# EAGLE board EEZ DIB MCU r3B3 (EAGLE 7.2.0), part 1 of 2
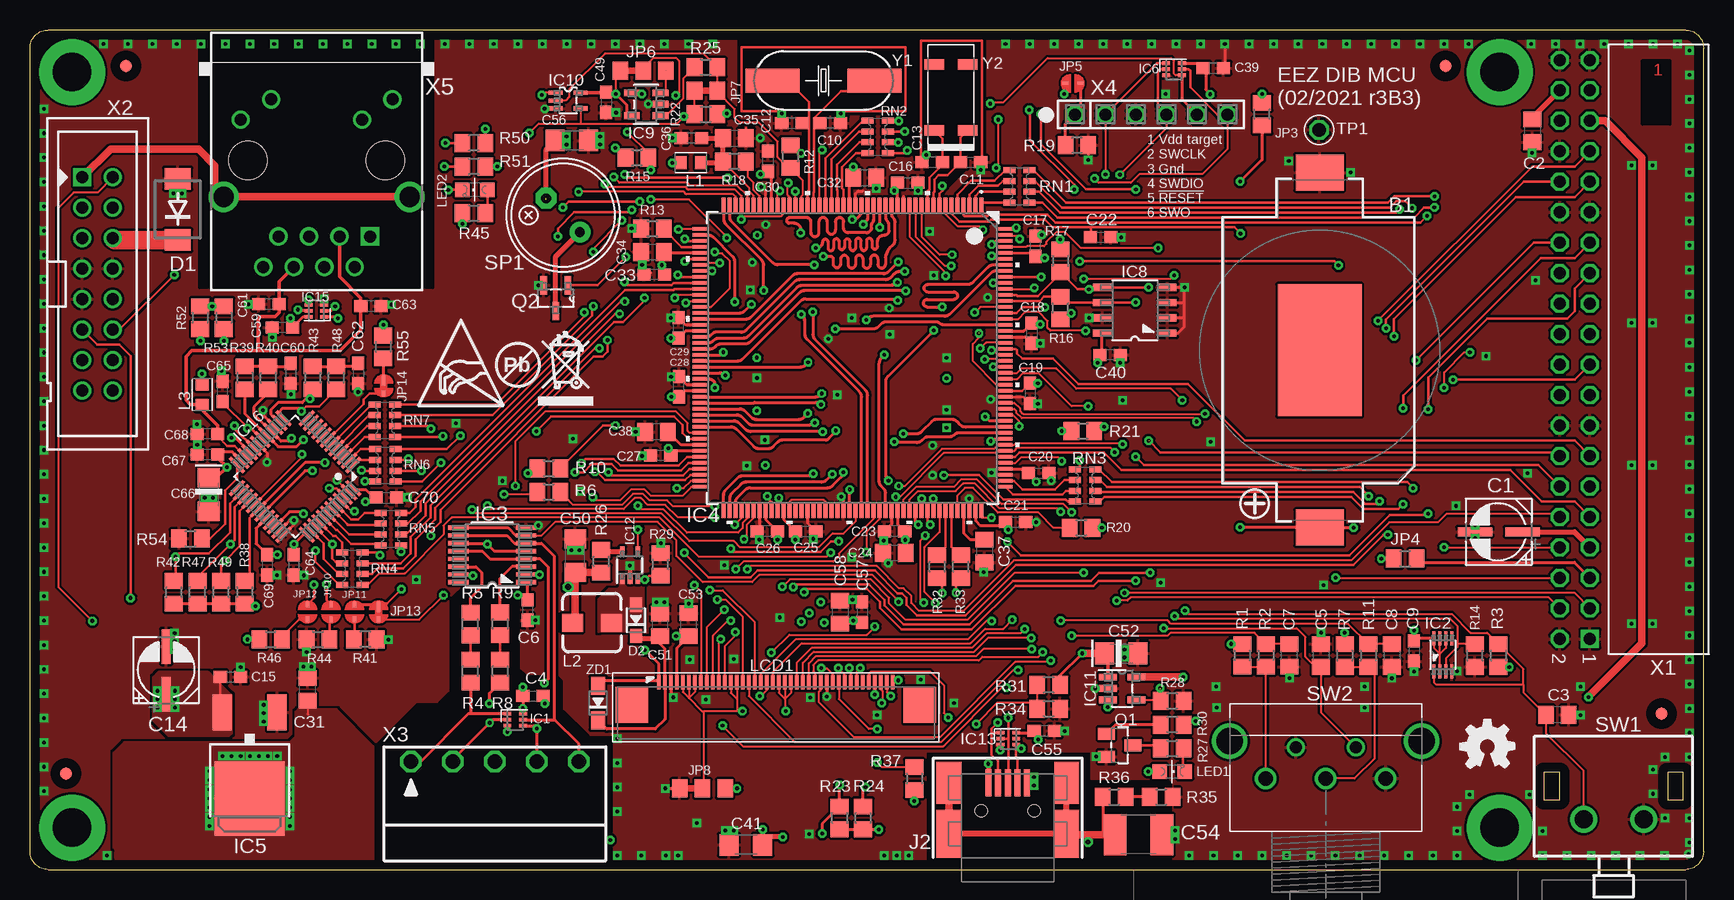
[diagram p5: board, top side]
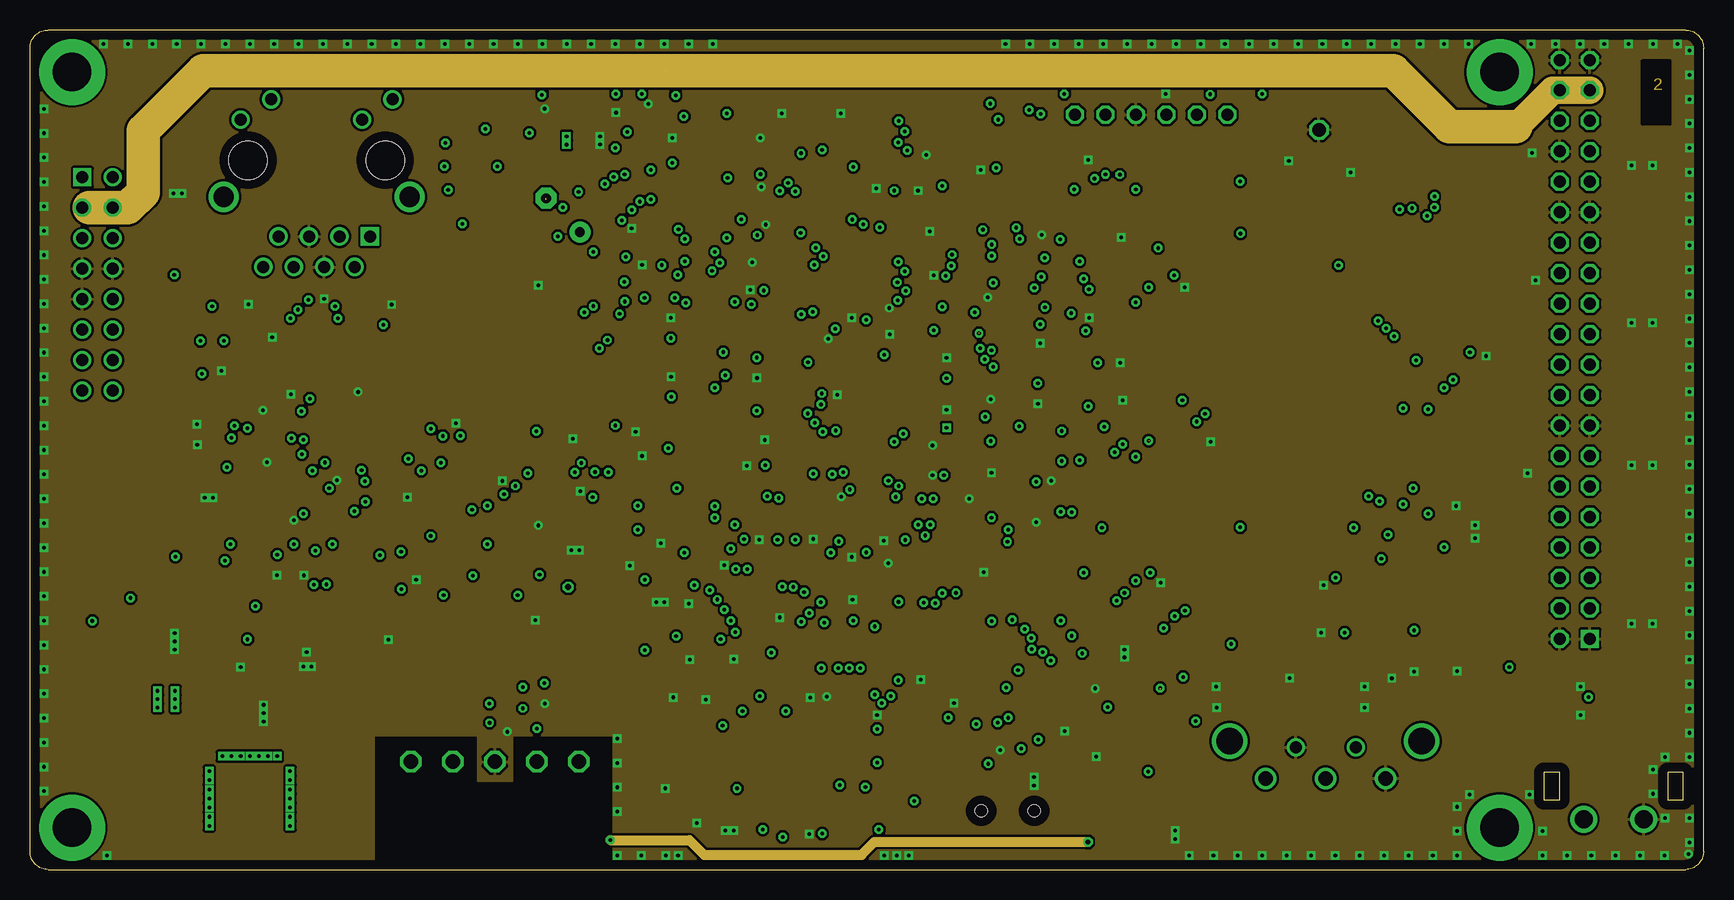
[diagram p6: board, inner layer Gnd]
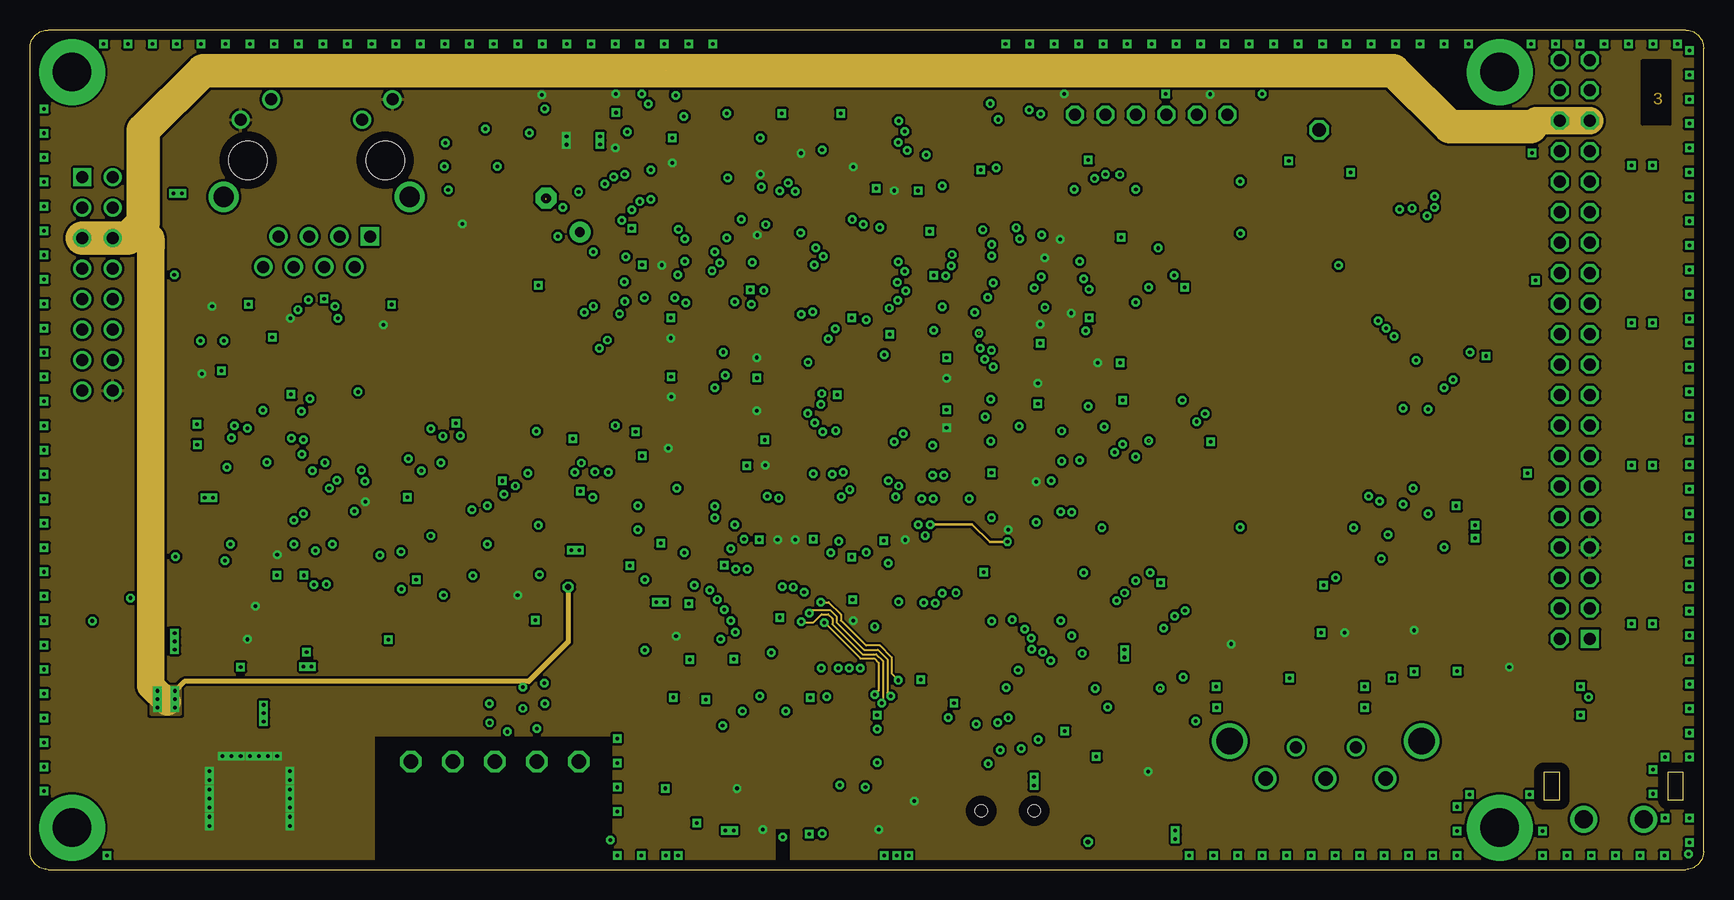
[diagram p7: board, inner layer Power]
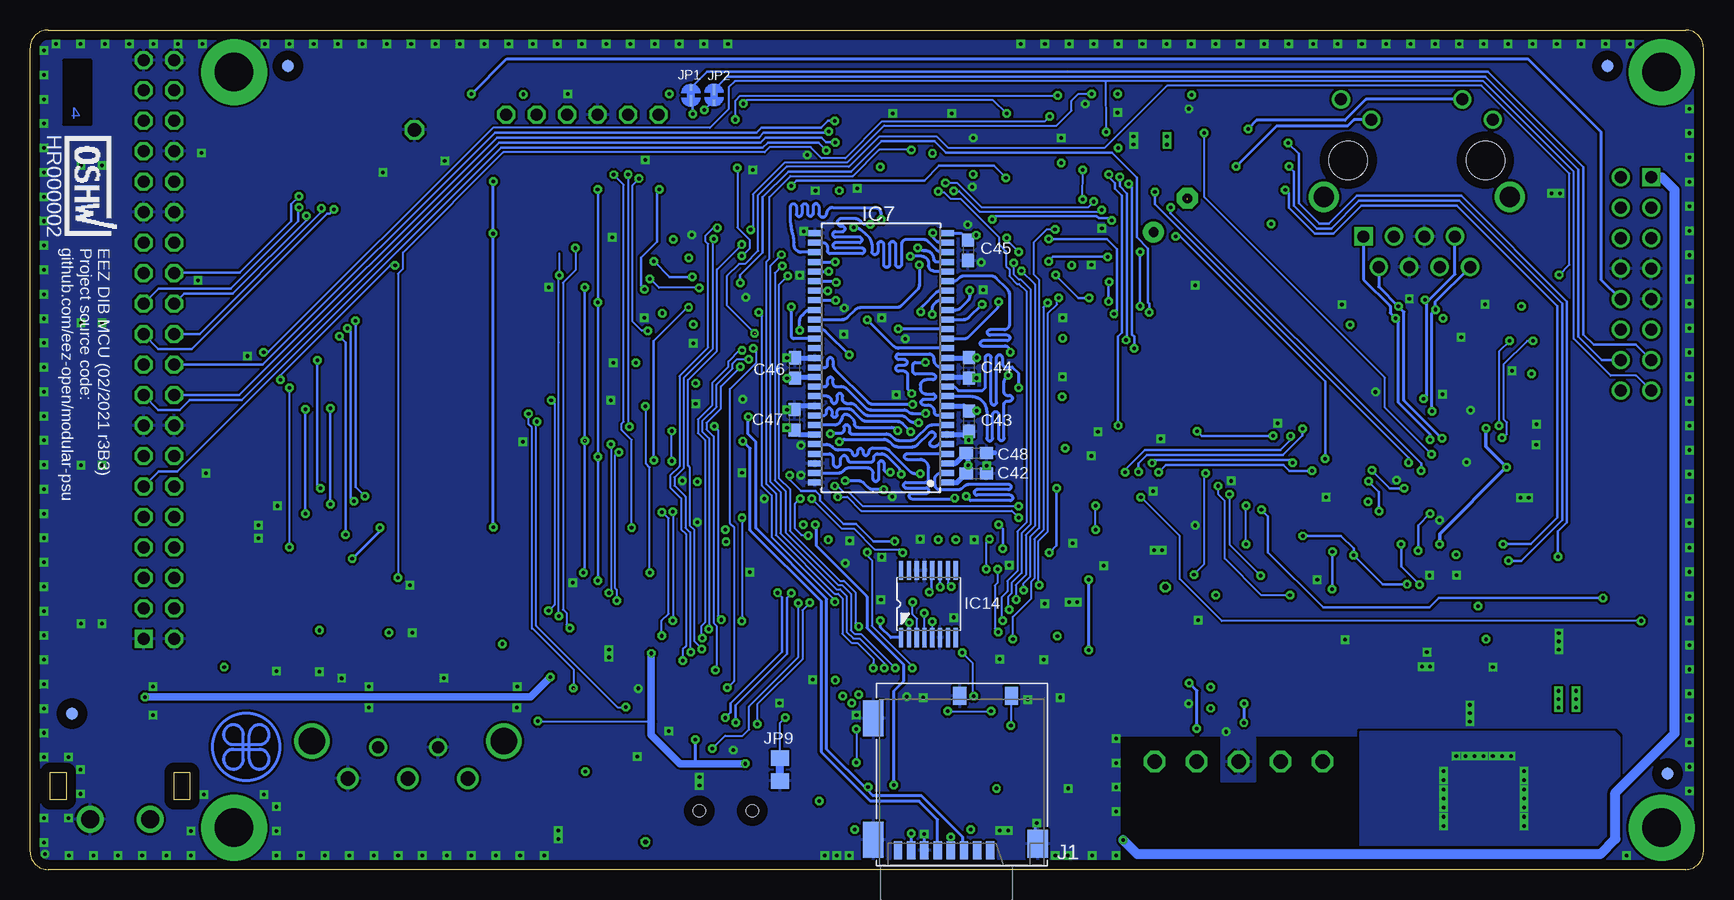
[diagram p8: board, bottom side, seen from below]

Size 139.5 x 70 mm. Coordinates in mm from the lower left corner, seen from the top.
Outline: 1.5,0 138,0 arc90 139.5,1.5 139.5,68.5 arc90 138,70 1.5,70 arc90 0,68.5 0,1.5 arc90 1.5,0
Copper layers (1+2+15+16): Top 0.035559375mm / dielectric 7mil / Gnd 0.03048125mm / dielectric 44mil / Power 0.03048125mm / dielectric 7mil / Bottom 0.035559375mm
Design rules "DIB 4-layer": minimum track width 6mil, minimum drill 0.3mm, track to track 4mil, track to pad 4mil, pad to pad 4mil, via to via 4mil, smd to smd 4mil, copper to edge 30mil, drill to drill 8mil, minimum pad ring 4mil, minimum via ring 8mil, stop-mask expansion 2.5mil, vias tented up to drill 0.6mm, thermal gap 8mil
Net classes: 0 default: width 0.152 mm, drill 0.3 mm, clearance 0.203 mm; 1 diff: width 0.229 mm, drill 0.3 mm, clearance 0.203 mm; 2 gnd: width 0.152 mm, drill 0.3 mm, clearance 0.203 mm

## Footprints (pad centres in the part's own frame; a part is rotated, then mirrored left to right if it is on the bottom)
DS1092-10-W6L = smd 3 x 4: + 14.8,0; - -14.8,0 | smd 11 x 7: PS1 0,0
PANASONIC_C = smd 2.87 x 0.762: 1 -1.981,0; 2 1.981,0
C0805 = smd 1.3 x 1.5: 1 -0.95,0; 2 0.95,0
C0603 = smd 1.1 x 1: 1 -0.85,0; 2 0.85,0
C1206 = smd 1.6 x 1.8: 1 -1.4,0; 2 1.4,0
EC1206 = smd 1.6 x 1.8: + -1.4,0; - 1.4,0
C1812 = smd 1.9 x 3.4: 1 -1.95,0; 2 1.95,0
DO214AA = smd 1.8 x 2.2: A 2.55,0; C -2.55,0
SOD323-R = smd 1.2 x 1: A 1.3,0; C -1.3,0
FIDUCIAL = smd 1.016 x 1.016: T 0,0
DRL6 = smd 0.654 x 0.301: 1 -0.65,0.5; 2 -0.65,0; 3 -0.65,-0.5; 4 0.65,-0.5; 5 0.65,0; 6 0.65,0.5
DCU8 = smd 1.168 x 0.254: 1 -1.372,0.75; 2 -1.372,0.25; 3 -1.372,-0.25; 4 -1.372,-0.75; 5 1.372,-0.75; 6 1.372,-0.25; 7 1.372,0.25; 8 1.372,0.75
PW16 = smd 1.676 x 0.356: 1 -2.819,2.275; 2 -2.819,1.625; 3 -2.819,0.975; 4 -2.819,0.325; 5 -2.819,-0.325; 6 -2.819,-0.975; 7 -2.819,-1.625; 8 -2.819,-2.275; 9 2.819,-2.275; 10 2.819,-1.625; 11 2.819,-0.975; 12 2.819,-0.325; 13 2.819,0.325; 14 2.819,0.975; 15 2.819,1.625; 16 2.819,2.275
LQFP-176_24X24MM = smd 1.2 x 0.3: 1 -12.75,10.75; 2 -12.75,10.25; 3 -12.75,9.75; 4 -12.75,9.25; 5 -12.75,8.75; 6 -12.75,8.25; 7 -12.75,7.75; 8 -12.75,7.25; 9 -12.75,6.75; 10 -12.75,6.25; 11 -12.75,5.75; 12 -12.75,5.25; 13 -12.75,4.75; 14 -12.75,4.25; 15 -12.75,3.75; 16 -12.75,3.25; 17 -12.75,2.75; 18 -12.75,2.25; 19 -12.75,1.75; 20 -12.75,1.25; 21 -12.75,0.75; 22 -12.75,0.25; 23 -12.75,-0.25; 24 -12.75,-0.75; 25 -12.75,-1.25; 26 -12.75,-1.75; 27 -12.75,-2.25; 28 -12.75,-2.75; 29 -12.75,-3.25; 30 -12.75,-3.75; 31 -12.75,-4.25; 32 -12.75,-4.75; 33 -12.75,-5.25; 34 -12.75,-5.75; 35 -12.75,-6.25; 36 -12.75,-6.75; 37 -12.75,-7.25; 38 -12.75,-7.75; 39 -12.75,-8.25; 40 -12.75,-8.75; 41 -12.75,-9.25; 42 -12.75,-9.75; 43 -12.75,-10.25; 44 -12.75,-10.75; 89 12.75,-10.75; 90 12.75,-10.25; 91 12.75,-9.75; 92 12.75,-9.25; 93 12.75,-8.75; 94 12.75,-8.25; 95 12.75,-7.75; 96 12.75,-7.25; 97 12.75,-6.75; 98 12.75,-6.25; 99 12.75,-5.75; 100 12.75,-5.25; 101 12.75,-4.75; 102 12.75,-4.25; 103 12.75,-3.75; 104 12.75,-3.25; 105 12.75,-2.75; 106 12.75,-2.25; 107 12.75,-1.75; 108 12.75,-1.25; 109 12.75,-0.75; 110 12.75,-0.25; 111 12.75,0.25; 112 12.75,0.75; 113 12.75,1.25; 114 12.75,1.75; 115 12.75,2.25; 116 12.75,2.75; 117 12.75,3.25; 118 12.75,3.75; 119 12.75,4.25; 120 12.75,4.75; 121 12.75,5.25; 122 12.75,5.75; 123 12.75,6.25; 124 12.75,6.75; 125 12.75,7.25; 126 12.75,7.75; 127 12.75,8.25; 128 12.75,8.75; 129 12.75,9.25; 130 12.75,9.75; 131 12.75,10.25; 132 12.75,10.75 | smd 0.3 x 1.2: 45 -10.75,-12.75; 46 -10.25,-12.75; 47 -9.75,-12.75; 48 -9.25,-12.75; 49 -8.75,-12.75; 50 -8.25,-12.75; 51 -7.75,-12.75; 52 -7.25,-12.75; 53 -6.75,-12.75; 54 -6.25,-12.75; 55 -5.75,-12.75; 56 -5.25,-12.75; 57 -4.75,-12.75; 58 -4.25,-12.75; 59 -3.75,-12.75; 60 -3.25,-12.75; 61 -2.75,-12.75; 62 -2.25,-12.75; 63 -1.75,-12.75; 64 -1.25,-12.75; 65 -0.75,-12.75; 66 -0.25,-12.75; 67 0.25,-12.75; 68 0.75,-12.75; 69 1.25,-12.75; 70 1.75,-12.75; 71 2.25,-12.75; 72 2.75,-12.75; 73 3.25,-12.75; 74 3.75,-12.75; 75 4.25,-12.75; 76 4.75,-12.75; 77 5.25,-12.75; 78 5.75,-12.75; 79 6.25,-12.75; 80 6.75,-12.75; 81 7.25,-12.75; 82 7.75,-12.75; 83 8.25,-12.75; 84 8.75,-12.75; 85 9.25,-12.75; 86 9.75,-12.75; 87 10.25,-12.75; 88 10.75,-12.75; 133 10.75,12.75; 134 10.25,12.75; 135 9.75,12.75; 136 9.25,12.75; 137 8.75,12.75; 138 8.25,12.75; 139 7.75,12.75; 140 7.25,12.75; 141 6.75,12.75; 142 6.25,12.75; 143 5.75,12.75; 144 5.25,12.75; 145 4.75,12.75; 146 4.25,12.75; 147 3.75,12.75; 148 3.25,12.75; 149 2.75,12.75; 150 2.25,12.75; 151 1.75,12.75; 152 1.25,12.75; 153 0.75,12.75; 154 0.25,12.75; 155 -0.25,12.75; 156 -0.75,12.75; 157 -1.25,12.75; 158 -1.75,12.75; 159 -2.25,12.75; 160 -2.75,12.75; 161 -3.25,12.75; 162 -3.75,12.75; 163 -4.25,12.75; 164 -4.75,12.75; 165 -5.25,12.75; 166 -5.75,12.75; 167 -6.25,12.75; 168 -6.75,12.75; 169 -7.25,12.75; 170 -7.75,12.75; 171 -8.25,12.75; 172 -8.75,12.75; 173 -9.25,12.75; 174 -9.75,12.75; 175 -10.25,12.75; 176 -10.75,12.75
DPACK = smd 1.6 x 3: 1 -2.28,-4.8; 3 2.28,-4.8 | smd 5.8 x 6.2: 4 0,2.38
TSOPII-54 = smd 1.2 x 0.5: 1 -5.502,10.4; 2 -5.502,9.6; 3 -5.502,8.8; 4 -5.502,8; 5 -5.502,7.2; 6 -5.502,6.4; 7 -5.502,5.6; 8 -5.502,4.8; 9 -5.502,4; 10 -5.502,3.2; 11 -5.502,2.4; 12 -5.502,1.6; 13 -5.502,0.8; 14 -5.502,0; 15 -5.502,-0.8; 16 -5.502,-1.6; 17 -5.502,-2.4; 18 -5.502,-3.2; 19 -5.502,-4; 20 -5.502,-4.8; 21 -5.502,-5.6; 22 -5.502,-6.4; 23 -5.502,-7.2; 24 -5.502,-8; 25 -5.502,-8.8; 26 -5.502,-9.6; 27 -5.502,-10.4; 28 5.502,-10.4; 29 5.502,-9.6; 30 5.502,-8.8; 31 5.502,-8; 32 5.502,-7.2; 33 5.502,-6.4; 34 5.502,-5.6; 35 5.502,-4.8; 36 5.502,-4; 37 5.502,-3.2; 38 5.502,-2.4; 39 5.502,-1.6; 40 5.502,-0.8; 41 5.502,0; 42 5.502,0.8; 43 5.502,1.6; 44 5.502,2.4; 45 5.502,3.2; 46 5.502,4; 47 5.502,4.8; 48 5.502,5.6; 49 5.502,6.4; 50 5.502,7.2; 51 5.502,8; 52 5.502,8.8; 53 5.502,9.6; 54 5.502,10.4
SOIC127P600X173-8N = smd 1.55 x 0.6: 1 -2.7,1.9; 2 -2.7,0.63; 3 -2.7,-0.64; 4 -2.7,-1.91; 5 2.7,-1.91; 6 2.7,-0.64; 7 2.7,0.63; 8 2.7,1.9
SOT23-5L_STM = smd 1.321 x 0.559: 1 -1.194,0.95; 2 -1.194,0; 3 -1.194,-0.95; 4 1.194,-0.95; 5 1.194,0.95
SOT65P210X110-5N = smd 1.168 x 0.356: 1 -1.041,0.66; 2 -1.041,0; 3 -1.041,-0.66; 4 1.041,-0.66; 5 1.041,0.66
DBV5 = smd 1.473 x 0.559: 1 -1.194,0.95; 2 -1.194,0; 3 -1.194,-0.95; 4 1.194,-0.95; 5 1.194,0.95
DCK5 = smd 0.85 x 0.4: 1 -1.125,0.65; 2 -1.125,0; 3 -1.125,-0.65; 4 1.125,-0.65; 5 1.125,0.65
PW(R-PDSO-G16) = smd 1.6 x 0.35: 1 -2.8,2.3; 2 -2.8,1.65; 3 -2.8,1; 4 -2.8,0.35; 5 -2.8,-0.3; 6 -2.8,-0.95; 7 -2.8,-1.6; 8 -2.8,-2.25; 9 2.8,-2.25; 10 2.8,-1.6; 11 2.8,-0.95; 12 2.8,-0.3; 13 2.8,0.35; 14 2.8,1; 15 2.8,1.65; 16 2.8,2.3
PT48 = smd 1.676 x 0.279: 1 -4.115,2.75; 2 -4.115,2.25; 3 -4.115,1.75; 4 -4.115,1.25; 5 -4.115,0.75; 6 -4.115,0.25; 7 -4.115,-0.25; 8 -4.115,-0.75; 9 -4.115,-1.25; 10 -4.115,-1.75; 11 -4.115,-2.25; 12 -4.115,-2.75; 25 4.115,-2.75; 26 4.115,-2.25; 27 4.115,-1.75; 28 4.115,-1.25; 29 4.115,-0.75; 30 4.115,-0.25; 31 4.115,0.25; 32 4.115,0.75; 33 4.115,1.25; 34 4.115,1.75; 35 4.115,2.25; 36 4.115,2.75 | smd 0.279 x 1.676: 13 -2.75,-4.115; 14 -2.25,-4.115; 15 -1.75,-4.115; 16 -1.25,-4.115; 17 -0.75,-4.115; 18 -0.25,-4.115; 19 0.25,-4.115; 20 0.75,-4.115; 21 1.25,-4.115; 22 1.75,-4.115; 23 2.25,-4.115; 24 2.75,-4.115; 37 2.75,4.115; 38 2.25,4.115; 39 1.75,4.115; 40 1.25,4.115; 41 0.75,4.115; 42 0.25,4.115; 43 -0.25,4.115; 44 -0.75,4.115; 45 -1.25,4.115; 46 -1.75,4.115; 47 -2.25,4.115; 48 -2.75,4.115
5033981892 = smd 0.7 x 1.5: 1 4.45,12.6; 2 5.55,12.6; 3 6.65,12.6; 4 7.75,12.6; 5 8.85,12.6; 6 9.95,12.6; 7 11.05,12.6; 8 12.15,12.6 | smd 1.7 x 2.33: S 0.5,12.04 | smd 1.7 x 3: S1 14.2,11.7; S2 14.2,1.6 | smd 1.1 x 1.5: SW1 2.7,-0.3; SW2 7,-0.3
678038020 = smd 2.25 x 0.5: 1 6.225,1.6; 2 6.225,0.8; 3 6.225,0; 4 6.225,-0.8; 5 6.225,-1.6 | smd 4 x 2.05: SH1 2,-4.9; SH2 2,4.9 | smd 3.5 x 2.05: SH1.1 6.25,-4.9; SH2.2 6.25,4.9 | hole 1: 3.9,2.2; 3.9,-2.2
JP2-NOCUT = smd 0.889 x 0.254: 1 -0.445,0 | smd 0.508 x 0.254: 2 0.635,0
R_0805 = smd 1.3 x 1.5: 1 -0.95,0; 2 0.95,0
JP2-CUT = smd 0.508 x 0.254: 1 -0.635,0; 2 0.635,0
JP3-0805-CUT2 = smd 1.3 x 1.5: COM 0,0; NC 1.9,0; NO -1.9,0
JP2-0805-NOCUT = smd 1.3 x 1.5: 1 -0.95,0; 2 0.95,0
BEAD0603 = smd 1 x 1.1: P$1 -0.85,0; P$2 0.85,0
DE0403 = smd 1.5 x 1.75: 1 0,1.626; 2 0,-1.625
FPC_40 = smd 0.3 x 1.2: 1 -9.75,1.9; 2 -9.25,1.9; 3 -8.75,1.9; 4 -8.25,1.9; 5 -7.75,1.9; 6 -7.25,1.9; 7 -6.75,1.9; 8 -6.25,1.9; 9 -5.75,1.9; 10 -5.25,1.9; 11 -4.75,1.9; 12 -4.25,1.9; 13 -3.75,1.9; 14 -3.25,1.9; 15 -2.75,1.9; 16 -2.25,1.9; 17 -1.75,1.9; 18 -1.25,1.9; 19 -0.75,1.9; 20 -0.25,1.9; 21 0.25,1.9; 22 0.75,1.9; 23 1.25,1.9; 24 1.75,1.9; 25 2.25,1.9; 26 2.75,1.9; 27 3.25,1.9; 28 3.75,1.9; 29 4.25,1.9; 30 4.75,1.9; 31 5.25,1.9; 32 5.75,1.9; 33 6.25,1.9; 34 6.75,1.9; 35 7.25,1.9; 36 7.75,1.9; 37 8.25,1.9; 38 8.75,1.9; 39 9.25,1.9; 40 9.75,1.9 | smd 2.7 x 3: Z1 -12,0; Z2 12,0
LED_0805 = smd 1.2 x 1.2: A 0,-1.05; C 0,1.05
SOT23-BEC = smd 1 x 1.4: B -0.95,-1.1; C 0,1.1; E 0.95,-1.1
SOT103P240X110-3N = smd 1.524 x 0.559: 1 -1.079,1.016; 2 -1.079,-1.016; 3 1.079,0
R0805 = smd 1.3 x 1.5: 1 -0.95,0; 2 0.95,0
CAY16 = smd 0.5 x 1: 1 -1.35,-0.85; 2 -0.45,-0.85; 3 0.45,-0.85; 4 1.35,-0.85; 5 1.35,0.85; 6 0.45,0.85; 7 -0.45,0.85; 8 -1.35,0.85
SHORT_NOHOLE = smd 0.5 x 0.25 bottom: P$1 0,0.117; P$2 0,-0.117
LD-BZEN-0903 = drill 0.8 pad 1.778 octagon: +B 2,0 | drill 0.8 pad 1.778: -B -2,0
TL1100C = drill 1.5: 1 0,2.5; 2 0,-2.5
PEC16-2215F = drill 1.2: A 0,-5; B 0,0; C 0,5 | drill 1: D -2.6,-2.5; E -2.6,2.5 | drill 2.2: GND1 -3.1,8; GND2 -3.1,-8
PCB_SHIELD_TAB = drill 1.1 octagon: 1 0,0
ZL263-40DG = drill 1 pad 1.5 square: 1 48.26,2.54 | drill 1 pad 1.5 octagon: 2 48.26,0; 3 45.72,2.54; 4 45.72,0; 5 43.18,2.54; 6 43.18,0; 7 40.64,2.54; 8 40.64,0; 9 38.1,2.54; 10 38.1,0; 11 35.56,2.54; 12 35.56,0; 13 33.02,2.54; 14 33.02,0; 15 30.48,2.54; 16 30.48,0; 17 27.94,2.54; 18 27.94,0; 19 25.4,2.54; 20 25.4,0; 21 22.86,2.54; 22 22.86,0; 23 20.32,2.54; 24 20.32,0; 25 17.78,2.54; 26 17.78,0; 27 15.24,2.54; 28 15.24,0; 29 12.7,2.54; 30 12.7,0; 31 10.16,2.54; 32 10.16,0; 33 7.62,2.54; 34 7.62,0; 35 5.08,2.54; 36 5.08,0; 37 2.54,2.54; 38 2.54,0; 39 0,2.54; 40 0,0
IDC-16PIN = drill 1 pad 1.422 square: 1 -8.89,-1.27 | drill 1 pad 1.422: 2 -8.89,1.27; 3 -6.35,-1.27; 4 -6.35,1.27; 5 -3.81,-1.27; 6 -3.81,1.27; 7 -1.27,-1.27; 8 -1.27,1.27; 9 1.27,-1.27; 10 1.27,1.27; 11 3.81,-1.27; 12 3.81,1.27; 13 6.35,-1.27; 14 6.35,1.27; 15 8.89,-1.27; 16 8.89,1.27
MC1,5/5-G-3,5 = drill 1.2 octagon: 1 -7,0; 2 -3.5,0; 3 0,0; 4 3.5,0; 5 7,0
SSW-106-02-S-S = drill 1 pad 1.5 octagon: 1 -6.35,0; 2 -3.81,0; 3 -1.27,0; 4 1.27,0; 5 3.81,0; 6 6.35,0
RJ45-TRAFO-LED = drill 1 pad 1.524 square: 1 -4.445,6.35 | drill 1 pad 1.524: 2 -3.175,8.89; 3 -1.905,6.35; 4 -0.635,8.89; 5 0.635,6.35; 6 1.905,8.89; 7 3.175,6.35; 8 4.445,8.89; 9 -6.325,-5.08; 10 -3.785,-3.38; 11 3.785,-5.08; 12 6.325,-3.38 | drill 1.7 pad 2.54: SH -7.75,3.05; SH2 7.75,3.05 | hole 3.2: -5.715,0; 5.715,0
HC-49/4H = smd 4.5 x 2: 1 -4.25,0; 2 4.25,0
85SMX = smd 0.9 x 1.6: 1 -2.75,-1.4; 4 -2.75,1.4; NC.2 2.75,-1.4; NC.3 2.75,1.4
SOD323-W = smd 1.5 x 1.2: A 1.45,0; C -1.45,0

## Placement (x,y rotation side)
B1  DS1092-10-W6L  [DS1092-10-W6L]  107.5,43.31 270 top
C1  EEEFK1V220R  [PANASONIC_C]  122.42,28.16 180 top
C2  2u2  [C0805]  125.22,61.59 270 top
C3  10n  [C0805]  127.31,12.89 180 top
C4  100n  [C0603]  41.93,14.47 0 top
C5  10n  [C0805]  107.62,17.84 270 top
C6  100n  [C0603]  41.46,21.64 270 top
C7  10n  [C0805]  104.99,17.86 90 top
C8  10n  [C0805]  113.52,17.84 270 top
C9  100n  [C0603]  115.36,18.22 270 top
C10  33p  [C0603]  66.71,62.24 180 top
C11  4p7  [C0603]  78.41,58.97 0 top
C12  33p  [C0603]  63.51,62.24 0 top
C13  4p7  [C0603]  75.21,58.97 180 top
C14  EEEFK1V220R  [PANASONIC_C]  11.35,16.61 90 top
C15  100n  [C0603]  16.72,16.05 0 top
C16  100n  [C0603]  73.17,57.25 0 top
C17  100n  [C0603]  83.83,51.97 90 top
C18  100n  [C0603]  83.5,44.72 270 top
C19  100n  [C0603]  83.36,39.7 270 top
C20  100n  [C0603]  84.08,33.06 0 top
C21  100n  [C0603]  82.15,28.97 0 top
C22  100n  [C0603]  89.25,52.72 0 top
C23  100n  [C0603]  72.07,28.21 180 top
C24  1u  [C0805]  72.06,26.38 180 top
C25  100n  [C0603]  64.65,28.21 0 top
C26  100n  [C0603]  61.46,28.21 180 top
C27  100n  [C0603]  52.57,34.52 180 top
C28  100n  [C0603]  54.09,40.26 90 top
C29  100n  [C0603]  54.06,45.16 90 top
C30  100n  [C0603]  61.54,59.05 90 top
C31  2u2  [C0805]  23.14,15.02 90 top
C32  2u2  [C0805]  69.58,57.68 0 top
C33  100n  [C0603]  52.04,49.61 180 top
C34  1u  [C0805]  51.89,51.46 180 top
C35  1u  [C0805]  58.72,60.99 0 top
C36  100n  [C0603]  55.14,60.99 180 top
C37  2u2  [C0805]  79.55,26.56 270 top
C38  2u2  [C0805]  52.22,36.49 180 top
C39  N.C.  [C0603]  98.62,66.83 0 top
C40  100n  [C0603]  90.04,42.9 180 top
C41  4u7  [C1206]  59.67,2.06 180 top
C42  100n  [C0603]  60.61,33.02 0 bottom
C43  100n  [C0603]  61.25,37.39 270 bottom
C44  100n  [C0603]  61.25,41.83 270 bottom
C45  100n  [C0603]  61.3,51.64 270 bottom
C46  100n  [C0603]  75.74,41.82 90 bottom
C47  100n  [C0603]  75.75,37.5 90 bottom
C48  100n  [C0603]  60.61,34.73 0 bottom
C49  N.C.  [C0603]  48.04,63.97 270 top
C50  4u7  [C1206]  45.45,26.17 90 top
C51  1u  [C0805]  52.54,20.4 90 top
C52  4u7  [EC1206]  90.97,18.02 0 top
C53  2u2  [C0805]  54.91,20.41 90 top
C54  4n7/1kV  [C1812]  92.4,2.91 180 top
C55  100n  [C0603]  84.55,11.56 180 top
C56  4u7  [C1206]  45.17,60.78 180 top
C57  100n  [C0603]  69.36,21.46 270 top
C58  1u  [C0805]  67.52,21.46 270 top
C59  N.C.  [C0603]  21.04,45.19 180 top
C60  100n  [C0603]  21.73,41.36 270 top
C61  100n  [C0603]  19.92,47.16 0 top
C62  100n  [C0603]  27.36,41.36 270 top
C63  100n  [C0603]  28.43,46.96 180 top
C64  100n  [C0603]  21.98,25.4 270 top
C65  100n  [C0603]  16.07,39.87 90 top
C66  10u  [EC1206]  14.89,31.27 270 top
C67  100n  [C0603]  14.79,34.59 180 top
C68  100n  [C0603]  14.79,36.31 180 top
C69  100n  [C0603]  19.77,25.4 270 top
C70  100n  [C0603]  29.71,31 0 top
D1  SMBJ5.0A-TR  [DO214AA]  12.32,55.04 90 top
D2  RB751V40T1G  [SOD323-R]  50.5,20.78 90 top
EEZ_SIGNATURE  SIGNATURESMALL  [SIGNATURE_5MM]  121.47,10.22 180 top
FM1  FIDUCIAL  [FIDUCIAL]  136,13 0 top
FM2  FIDUCIAL  [FIDUCIAL]  3,8 0 top
FM3  FIDUCIAL  [FIDUCIAL]  8,67 0 top
FM4  FIDUCIAL  [FIDUCIAL]  118,67 0 top
FM5  FIDUCIAL  [FIDUCIAL]  3,8 0 bottom
FM6  FIDUCIAL  [FIDUCIAL]  8,67 0 bottom
FM7  FIDUCIAL  [FIDUCIAL]  136,13 0 bottom
FM8  FIDUCIAL  [FIDUCIAL]  118,67 0 bottom
IC1  TPD4E001DRLR  [DRL6]  40.45,12.48 0 top
IC2  74AUP1G74DC.125  [DCU8]  117.78,17.91 90 top
IC3  CD74HC4050PWR  [PW16]  38.53,26.23 180 top
IC4  STM32F769IIT6  [LQFP-176_24X24MM]  68.56,42.66 270 top
IC5  LD1117ADT33TR  [DPACK]  18.31,8.29 180 top
IC6  N.C.  [DRL6]  95.36,66.73 0 top
IC7  IS42S16400J  [TSOPII-54]  68.56,42.66 180 bottom
IC8  AT24C256C-SSHL-B  [SOIC127P600X173-8N]  92.1,46.63 180 top
IC9  N.C.  [SOT23-5L_STM]  51.35,63.8 180 top
IC10  N.C.  [SOT65P210X110-5N]  44.87,64.11 0 top
IC11  TPS2051BDBVR  [DBV5]  91.04,15.1 0 top
IC12  TPS61169DCKR  [DCK5]  50.02,25.37 90 top
IC13  TPD4E001DRLR  [DRL6]  81.56,10.91 0 top
IC14  TSC2007IPW  [PW(R-PDSO-G16)]  64.59,22.14 90 bottom
IC15  N.C.  [DRL6]  23.87,46.58 180 top
IC16  DP83848CVV/NOPB  [PT48]  22.11,32.77 225 top
J1  503398-1892  [5033981892]  55,14.2 180 bottom
J2  67803-8020  [678038020]  81.5,1 90 top
JP1  JP2-NOCUT  [JP2-NOCUT]  84.41,64.55 90 bottom
JP2  JP2-NOCUT  [JP2-NOCUT]  82.48,64.58 270 bottom
JP3  [R_0805]  102.69,62.98 90 top
JP4  [R_0805]  114.63,25.92 0 top
JP5  JP2-CUT  [JP2-CUT]  86.92,65.54 0 top
JP6  JP3-CUT-0805-ROTATED  [JP3-0805-CUT2]  51.11,66.6 180 top
JP7  JP2-NOCUT-0805  [JP2-0805-NOCUT]  56.35,64.94 0 top
JP8  JP3-CUT-0805-ROTATED  [JP3-0805-CUT2]  56.05,6.77 180 top
JP9  JP2-NOCUT-0805  [JP2-0805-NOCUT]  77,8.33 270 bottom
JP10  JP2-CUT  [JP2-CUT]  25.09,21.48 270 top
JP11  JP2-CUT  [JP2-CUT]  27.05,21.48 270 top
JP12  JP2-CUT  [JP2-CUT]  23.14,21.48 90 top
JP13  JP2-NOCUT  [JP2-NOCUT]  29.07,21.48 270 top
JP14  JP2-NOCUT  [JP2-NOCUT]  29.49,40.34 270 top
L1  BLM18AG102SH1D  [BEAD0603]  55.09,58.94 0 top
L2  DLG-0403-4R7  [DE0403]  46.85,20.57 90 top
L3  BLM18AG102SH1D  [BEAD0603]  14.35,39.6 270 top
LABEL1  HR000002  [CERT-SMALL-SILK]  136.61,57 270 bottom
LCD1  505110-4091  [FPC_40]  62.18,13.72 0 top
LED1  N.C.  [LED_0805]  95.21,8.17 270 top
LED2  N.C.  [LED_0805]  37.08,56.68 90 top
Q1  N.C.  [SOT23-BEC]  90.83,10.36 270 top
Q2  2N7002  [SOT103P240X110-3N]  43.82,47.64 270 top
R1  4K7  [R0805]  101.05,17.86 270 top
R2  10K  [R0805]  103.02,17.86 270 top
R3  10K  [R0805]  122.41,17.84 90 top
R4  4K7  [R0805]  36.71,16.54 90 top
R5  4K7  [R0805]  36.71,20.47 90 top
R6  1K  [R0805]  43.25,31.47 0 top
R7  4K7  [R0805]  109.58,17.84 270 top
R8  4K7  [R0805]  39.2,16.55 90 top
R9  4K7  [R0805]  39.2,20.49 90 top
R10  1K  [R0805]  43.25,33.44 0 top
R11  10K  [R0805]  111.55,17.84 270 top
R12  N.C.  [R0805]  63.38,59.44 270 top
R13  10K  [R0805]  51.89,53.44 0 top
R14  N.C.  [R0805]  120.44,17.84 90 top
R15  4K7  [R0805]  50.59,59.35 0 top
R16  1K5  [R0805]  85.89,46.81 90 top
R17  1K5  [R0805]  85.89,50.76 270 top
R18  47R  [R0805]  58.72,59.02 180 top
R19  N.C.  [R0805]  87.27,60.38 180 top
R20  N.C.  [R0805]  87.61,28.5 0 top
R21  N.C.  [R0805]  87.77,36.56 0 top
R22  N.C.  [R0805]  56.35,62.97 0 top
R23  47K  [R0805]  67.5,4.31 90 top
R24  47K  [R0805]  69.45,4.31 90 top
R25  N.C.  [R0805]  56.35,66.89 0 top
R26  10R  [R0805]  47.62,25.69 90 top
R27  N.C.  [R0805]  95.21,10.11 0 top
R28  10K  [R0805]  95.21,14.05 180 top
R29  10R  [R0805]  52.56,25.44 90 top
R30  N.C.  [R0805]  95.21,12.08 180 top
R31  4K7  [R0805]  84.92,15.39 180 top
R32  22R  [R0805]  75.62,25.25 90 top
R33  22R  [R0805]  77.59,25.25 90 top
R34  10K  [R0805]  84.91,13.41 0 top
R35  470K  [R0805]  94.29,6.05 0 top
R36  470K  [R0805]  90.37,6.05 0 top
R37  10K  [R0805]  73.72,7.58 270 top
R38  1K5  [R0805]  17.9,23.11 270 top
R39  49R9  [R0805]  17.92,41 270 top
R40  49R9  [R0805]  19.87,41 90 top
R41  N.C.  [R0805]  27.95,19.2 180 top
R42  2K2  [R0805]  12,23.11 90 top
R43  49R9  [R0805]  23.57,41 270 top
R44  N.C.  [R0805]  24.01,19.19 0 top
R45  N.C.  [R0805]  37,54.72 0 top
R46  N.C.  [R0805]  20.06,19.19 0 top
R47  2K2  [R0805]  13.97,23.11 90 top
R48  49R9  [R0805]  25.54,41 90 top
R49  2K2  [R0805]  15.93,23.11 90 top
R50  220R  [R0805]  37,60.58 180 top
R51  220R  [R0805]  37,58.61 180 top
R52  2K2  [R0805]  14.19,46.01 270 top
R53  2K2  [R0805]  16.16,46.01 270 top
R54  4K87  [R0805]  13.37,27.58 0 top
R55  2K2  [R0805]  29.45,43.57 270 top
RN1  DR1206-33R-4/8  [CAY16]  82.48,56.96 90 top
RN2  DR1206-33R-4/8  [CAY16]  70.67,61.09 90 top
RN3  DR1206-33R-4/8  [CAY16]  87.94,32.02 90 top
RN4  DR1206-33R-4/8  [CAY16]  26.87,25.08 90 top
RN5  DR1206-33R-4/8  [CAY16]  30.08,28.38 90 top
RN6  DR1206-33R-4/8  [CAY16]  29.61,33.69 90 top
RN7  DR1206-33R-4/8  [CAY16]  29.59,37.43 90 top
SH1  [SHORT_NOHOLE]  43.02,55.97 180 bottom
SP1  LD-BZEN 0903  [LD-BZEN-0903]  44.43,54.56 135 top
SW1  TL1100CF160Q  [TL1100C]  132,4.2 90 top
SW2  PEC16-2215F-S0024  [PEC16-2215F]  108,7.6 270 top
TP1  [PCB_SHIELD_TAB]  107.45,61.67 0 top
U$1  [RECYCLE_BIN1/8]  42.35,38.68 0 top
U$5  [PB_SMALL]  40.67,42.09 180 top
U$6  [ESD_SYMBOL]  32.37,38.7 0 top
X1  DS1024-2*20R0  [ZL263-40DG]  127.5,67.5 270 top
X2  DS1013-16SSIB1  [IDC-16PIN]  5.63,48.82 270 top
X3  691322110005  [MC1,5/5-G-3,5]  38.75,9 0 top
X4  N.C.  [SSW-106-02-S-S]  93.46,62.95 0 top
X5  LMJTAB881243M-L  [RJ45-TRAFO-LED]  23.9,59.14 180 top
Y1  25MHz  [HC-49/4H]  66.15,65.79 0 top
Y2  XTAL016178-85SMX  [85SMX]  76.77,64.38 90 top
ZD1  BZX384-B24.115  [SOD323-W]  47.35,13.88 90 top

## Tracks (layer width: path | path; a pad name or v marks a point on that pad's centre or on a via)
!FAULT  (via drill 0.3)
  Top 0.152: v117.86,26.86 X1.8 | IC4.58 56.76,46.91 58.34,48.49 58.34,50.71 57.69,51.36 57.21,51.36 v57.08,51.49 | v58.1,52.68 58.1,52.72 54.95,55.87 v51.76,55.87 | v117.88,40.16 117.88,41.45 119.55,43.13 v120.02,43.13 | 51.69,59.49 R15.2 | v51.75,58.34 51.75,59.14 R15.2 | R15.2 51.54,59.73 v49.78,61.49
  Bottom 0.152: v120.02,43.13 119.63,43.13 100.91,61.85 82.83,61.85 81.26,63.41 81.26,65.22 80.74,65.73 49.79,65.73 | v117.88,40.16 117.88,26.87 v117.86,26.86 | X2.15 5.62,41.19 7.74,41.19 10.82,44.26 10.82,58.19 18.36,65.73 49.79,65.73 | v51.76,55.87 v51.75,58.34 | v58.1,52.68 58.1,52.5 v57.08,51.49 | v49.78,61.49 49.79,65.73
!RESET  (via drill 0.3)
  Top 0.152: v108.82,24.32 X1.6 | IC16.29 22.68,34.4 v22.68,34.63 | v41.63,61.42 42.41,62.2 45.93,62.2 | IC10.4 45.91,62.23 45.93,62.2 | JP7.1 R22.1 54.68,62.97 v54.51,62.79 53.92,62.2 45.93,62.2
  Bottom 0.152: v108.82,24.32 108.82,49.68 108.4,50.1 108.4,51.45 100.05,59.8 78.27,59.8 77.83,60.24 74.43,60.24 73.5,59.31 71.53,59.31 68.46,62.38 54.91,62.38 v54.51,62.79 | v22.68,34.63 26.55,38.51 26.55,41.01 41.6,56.06 41.6,61.39 v41.63,61.42
!USB_OTG_FS_OC  (via drill 0.3)
  Top 0.152: 89.84,14.14 IC11.3 v89.85,13.55 v89.84,13.54 | IC4.146 82.05,38.41 82.19,38.27 82.19,38.11 82.67,37.63 97.01,37.63 97.27,37.38 v97.27,37.35
  Bottom 0.152: v97.27,37.35 97.3,37.31 97.3,20.32 90.52,13.54 v89.84,13.54
+3V3  (via drill 0.3)
  Top 0.152: R1.1 v100.14,18.81 | R7.1 v109.58,19.75 | IC5.4 v14.94,5.92 | v36.05,53.82 R45.1 | C9.1 v115.36,19.94 | IC2.2 117.53,17.97 | 117.53,17.97 IC2.7 | IC2.8 117.03,18.47 117.53,17.97 | IC2.6 118.03,18.47 117.53,17.97 | C31.1 23.14,12.98 | 23.2,12.92 23.19,12.92 | v86.79,46.39 R16.1 | R17.1 v85.89,52.53 | C40.2 89.32,42.56 v89.01,42.25 | C33.1 52.68,49.82 v52.68,50.39 52.68,51.42 C34.1 | R12.1 63.61,60.39 v64.27,59.73 | v40.65,22.86 41.09,22.86 C6.1 | R3.1 v123.31,16.89 | R37.2 v73.72,5.7 | IC10.1 42.85,64.77 v42.67,64.59 | 49.76,62.97 49.85,62.87 49.87,62.88 IC9.5 | v48.84,64.66 48.84,66.6 JP6.NC
  Top 0.203: 98,66.83 C39.1 | LED1.A v93.21,8.17 | C69.1 v20.61,26.25 | R52.1 v15.18,46.96 v15.19,46.97 v15.19,46.96 R53.1 | v18.13,19.19 R46.1 | v72.04,56.6 C16.1 | C32.1 v68.63,58.58 v68.63,58.59 | IC4.172 83.54,51.41 C17.1 83.93,51.02 v84.58,51.02 | v81.53,28.33 C21.1 | R55.1 29.45,45.39 v29.47,45.41
  Top 0.229: IC4.149 82.7,39.91 C19.1
  Top 0.254: IC16.32 18.84,28.44 18.84,27.18 C69.1 19.64,26.26 | 17.46,21.72 R38.2 | v27.97,30.67 28.53,30.67 C70.1 28.67,31 28.04,31.64 27.13,31.64 IC16.48 | v53.86,19.46 C53.1 | 55.44,18.93 C53.1 | JP8.NO v58.94,6.77 | IC6.6 97.38,67.23 C39.1 | 98,66.83 98,65.02 v98.38,64.64 | R38.2 18.19,22.16 | R38.2 R49.1 R47.1 R42.1 | IC15.6 22.79,46.08 C59.1 21.89,45.8 v21.71,45.97 | v18.8,21.96 R38.2 | IC2.8 115.5,19.28 115.5,19.21 C9.1 | R23.1 R24.1 69.47,3.34 v70.76,3.34 | v44.73,60.44 44.24,60.31 C56.2 | v62.31,27.51 C26.1 61.31,29.21 IC4.96 | v63.8,27.51 C25.1 62.81,29.2 IC4.99 | IC4.72 54.59,39.91 C28.1 v53.45,39.41 | IC4.62 54.66,44.91 C29.1 v53.41,44.31 | IC4.49 52.69,51.41 C34.1 | IC4.131 78.81,29.09 79.24,28.66 81,28.66 C21.1 | LCD1.4 53.92,18.47 C53.1 | IC4.23 68.31,57.37 C32.1 | IC8.8 89.32,44.65 89.32,43.03 C40.2 | IC4.136 82.78,33.41 C20.1 83.6,32.59 v83.87,32.35 | C18.1 82.84,44.91 IC4.159 | IC4.15 C16.1 | C57.2 69.33,20.57 68.81,20.57 v68.61,20.77 68.42,20.57 67.84,20.57 67.78,20.51 C58.2 | IC4.118 72.31,28.81 C23.1 72.92,27.52 v72.96,27.48 73.02,27.42 C24.1 | v60.89,57.98 61.54,57.98 C30.1 | 61.69,57.83 C30.1 | v53.2,35.14 53.2,34.71 C27.1 53.85,34.91 IC4.82 | IC3.1 41.46,23.84 C6.1 | IC4.36 61.81,57.7 C30.1 | 49.76,62.97 49.76,63.74 v48.84,64.66 48.2,64.66 C49.1 | JP5.1 86.28,65.23 v86.22,64.66
  Top 0.305: L3.P$1 14.35,41.33 v14.34,41.34 | IC10.5 47.7,64.77 C49.1 | R15.1 49.6,59.35 v48.78,60.17
  Top 0.406: v61.07,3.34 61.07,2.85 | 61.07,2.85 C41.1 | v62.75,2.72 61.2,2.72 61.07,2.85 | v53.55,58.93 54.23,58.93 L1.P$1 | C19.1 84.03,40.54 v84.02,40.54 | C18.1 84.2,45.57 v84.2,45.47 | C1.1 128.74,28.16 X1.7 | 43.59,60.61 C56.2 43.02,60.04 SH1.P$2
  Bottom 0.254: C47.1 75.65,36.55 v76.4,36.84 | IC14.1 67.75,19.34 68.61,20.21 v68.61,20.77 | IC7.27 61.87,53.06 C45.1 61.21,52.49 v60.64,52.9
  Bottom 0.406: J1.4 v62.75,2.71 v62.75,2.72 | v60.59,42.69 v60.59,42.68 C44.1 61.27,42.66 IC7.14 | v76.4,40.97 C46.1 75.65,41.06 IC7.43 | C47.1 75.36,36.26 IC7.49 | IC7.1 62.22,32.26 C42.1 61.3,33.18 v61.29,33.69 61.3,34.57 C48.1 62.34,33.86 IC7.3 | IC7.9 61.67,38.66 C43.1 v60.59,38.24 | 63.08,53.08 IC7.27
  other vias: 14.94,5.16 14.94,4.39 14.94,6.68 14.94,7.44 14.94,8.2 14.94,3.63 21.68,3.63 21.68,4.39 21.68,5.16 21.68,5.92 21.68,6.68 21.68,7.44 21.68,8.2 18.32,9.45 17.56,9.45 16.8,9.45 19.08,9.45 19.85,9.45 16.04,9.45 20.61,9.45 44.73,61.14
  pour Power (isolate 0.203, rank 4): -0.07,69.34 139.62,69.85 139.62,0.76 63.48,0.76 63.48,3.49 62.02,3.49 62.02,0.76 48.69,0.76 48.69,11.18 28.62,11.18 28.62,0.25 -0.07,0.25
  pour Bottom (isolate 0.254, no thermals): 7.41,11.43 28.62,11.43 28.62,0.57 7.03,0.57 7.03,11.05
  pour Top (isolate 0.254, no thermals): 6.97,0.19 6.97,9.72 7.86,10.6 21.64,10.6 22.14,11.11 22.14,13.14 22.34,13.34 25.57,13.34 28.62,10.29 28.62,0.19
+3V3(A)
  Top 0.203: IC16.22 17.07,35.33 16.44,35.33 15.64,36.13 C68.1
  Top 0.254: 15.44,36.32 C68.1 | C63.2
  Top 0.305: C68.1 15.63,37.03 14.36,38.3 L3.P$2 14.32,38.77 13.36,38.77 13,39.13 13,42.79 13.5,43.28 19.01,43.28 | X5.6 20.77,49.03 C61.2 20.77,46.44 20.43,46.1 19.16,46.1 19.01,45.95 19.01,43.28 | X5.3 25.8,49.44 27.58,47.66 C63.2 27.58,45 25.87,43.28 19.01,43.28
+5V  (via drill 0.3, 0.5)
  Top 0.203: C4.1 41.09,14.43 v41.09,15.21 | C15.1 15.87,13.25 IC5.3
  Top 0.254: 41.09,14.43 41.09,13.45 v41.08,13.44 41.1,13.42 IC1.6
  Top 0.406: v10.64,14.2 C14.1 11.26,14.22 11.26,14.55 | 16.05,13.11 IC5.3 | D1.C 12.38,52.24
  Top 0.61: C50.1 45.45,20.57 L2.1 | R26.1 47.62,24.77 C50.1 | v44.87,23.55 44.87,24.77 C50.1 | 12.38,52.24 12.34,52.2 | v129.9,14.38 134.38,18.85 134.38,59.35 131.3,62.42 X1.35 | D1.C 12.32,52.51 | IC11.5 95.75,16.05 v96.11,16.05
  Top 1.016: IC5.3
  Top 1.524: IC5.3 16.03,12.36 16,12.33 | D1.C 7.04,52.49 X2.6
  Power 0.254: v41.09,15.21 41.09,15.6 41.17,15.67
  Power 0.406: v44.87,23.55 44.87,18.97 41.56,15.67 41.17,15.67 12.87,15.67 v12.1,14.9
  Power 0.61: 10.92,51.84 10.92,52.51 10.08,52.51 10.08,52.63
  Power 2.286: X1.35 X1.36 125.57,62.42 125.09,61.94 | 8.16,52.65 8.14,52.63 X2.6 10.08,52.63 10.08,15.32 11.43,13.97
  Power 2.794: 113.65,66.62 14.44,66.62 9.45,61.63 9.45,53.94 8.16,52.65 4.39,52.65 X2.5 | 113.65,66.62 113.65,66.61 | 125.09,61.94 118.33,61.94 113.65,66.62
  Bottom 0.406: 98.41,14.41 98.36,14.38
  Bottom 0.61: v129.9,14.38 98.36,14.38 97.79,14.38 v96.11,16.05
  other vias: 10.64,14.9 10.64,13.5 12.1,14.2 12.1,13.5
  pour Top (isolate 0.254, no thermals): 16.77,14.55 16.77,11.35 16.57,11.15 11.55,11.15 10.3,12.41 10.3,16.03 10.74,16.47 14.84,16.47 16.75,14.57
  pour Power (isolate 0.203, no thermals): 10.12,15.3 12.51,15.3 12.51,12.92 10.12,12.92
+12V
  Top 0.406: X1.38 125.28,62.74 C2.1
  Gnd 0.406: 4.95,55.17 X2.3 | 123.95,61.96 123.92,61.94 123.83,61.94
  Gnd 2.286: 123.95,61.96 126.94,64.96 126.95,64.96 X1.38 X1.37
  Gnd 2.794: 4.95,55.17 X2.4 8.15,55.17 9.43,56.45 9.43,61.62 14.44,66.62 113.64,66.62 118.32,61.94 123.83,61.94
+VAUX  (via drill 0.3)
  Top 0.254: JP3.2 102.69,64.64 v102.7,64.66
  Bottom 0.254: X2.10 8.54,49.19 8.54,61.52 14.63,67.6 99.75,67.6 v102.7,64.66
+VAUX_OUT
  Top 0.254: X1.5 128.74,25.62 115.88,25.62 JP4.2
BOOT0  (via drill 0.3)
  Top 0.152: 119,18.79 119,20.31 118.36,20.94 95.61,20.94 v95.42,21.13 | 119,18.79 119,18.55 118.03,17.59 IC2.3 | v87.83,49.25 95.09,49.25 v95.37,49.53 | IC4.166 83.65,48.41 v83.73,48.49 | R14.2 119,18.79
  Bottom 0.152: v95.42,21.13 95.42,43.94 | 95.42,43.94 95.42,49.48 v95.37,49.53 95.37,51.35 | 95.44,43.93 95.42,43.94 | v83.73,48.49 v83.74,48.5 87.08,48.5 v87.83,49.25
BYPASS_REG
  Top 0.203: IC4.48 54.32,51.91 52.84,53.39 R13.2
DAC_OUT1  (via drill 0.3)
  Top 0.203: IC4.50 54.78,50.91 v54.59,50.72 | v49.68,51.09 47.3,48.72 Q2.1
  Bottom 0.203: v49.68,51.09 54.23,51.09 v54.59,50.72
DIN2  (via drill 0.3)
  Top 0.203: IC4.8 75.81,56.36 76.06,56.6 v76.06,56.98 | v58.15,57.67 49.84,57.67 v49.56,57.95 | v48.8,37.02 47.78,37.02 R10.2
  Bottom 0.203: v58.15,57.67 59.15,58.67 63.71,58.67 64.94,57.44 75.6,57.44 v76.06,56.98 | 48.81,37.01 v48.8,37.02 48.8,44.42 48.46,44.77 48.46,56.19 49.06,56.78 49.06,57.21 49.56,57.72 v49.56,57.95
DOUT2  (via drill 0.3)
  Top 0.152: v72.4,22.31 72.4,22.39 70.24,24.55 60.79,24.55 60.21,23.96 56.07,23.96 53.9,26.14 53.9,27.42 52.32,28.99 43.77,28.99 42.63,27.85 IC3.7 | IC4.163 79.21,46.91 v78.75,46.44
  Top 0.254: IC3.9 39.83,28.5 40.48,27.85 IC3.7
  Bottom 0.152: v72.4,22.31 72.4,22.45 77.67,27.72 77.67,31.19 78.47,31.99 78.47,46.16 v78.75,46.44
ENC_A  (via drill 0.3)
  Top 0.152: IC4.119 72.81,30.86 73.87,31.91 77.01,31.91 77.62,32.52 78.93,32.52 80.98,30.47 86.17,30.47 v86.83,29.81 86.85,29.78 | C7.2 R2.1 102.08,19.75 95.07,19.75 94.8,19.48 v86.84,19.48
  Bottom 0.152: v86.83,29.81 86.8,29.81 86.27,29.27 86.27,21.32 86.84,20.75 v86.84,19.48
ENC_B  (via drill 0.3)
  Top 0.152: IC4.120 73.31,30.85 74.03,31.56 77.16,31.56 77.77,32.17 78.77,32.17 80.83,30.11 85.62,30.11 v85.91,29.82 | C8.1 R11.1 109.86,20.48 95.12,20.48 94.85,20.75 v85.91,20.75
  Bottom 0.152: v85.91,29.82 v85.91,20.75
ENC_SW  (via drill 0.3)
  Top 0.152: SW2.E 107.62,13.08 C5.2 107.16,16.89 106.32,17.73 106.32,19.39 105.6,20.12 v94.51,20.12 | v94.03,51.82 87.61,51.82 86.27,53.16 85.57,53.16 84.74,52.34 84.74,52.17 84.54,51.97 83.11,51.97 83.04,51.91 IC4.173 81.37,51.97
  Bottom 0.152: v94.03,51.82 94.03,49.97 95.07,48.93 95.07,21.68 94.79,21.4 94.79,20.4 v94.51,20.12
EOUT_A
  Top 0.152: R1.2 R2.2 103,16.89 SW2.A
EOUT_B
  Top 0.152: R7.2 R11.2 112.1,16.35 112.1,9.28 110.42,7.6 SW2.B
ETH_COL  (via drill 0.3)
  Top 0.203: RN5.2 31.37,27.93 32.97,29.53 32.97,30.52 48.76,46.32 v49.15,46.32 | IC4.47 54.76,52.41 v54.59,52.58
  Top 0.254: RN5.2
  Bottom 0.203: v54.59,52.58 49.73,52.58 48.88,51.73 48.88,46.58 v49.15,46.32
ETH_CRS  (via drill 0.3)
  Top 0.152: IC4.40 59.81,56.17 58.95,57.04 55.02,57.04 54.81,57.25 49.15,57.25 v48.65,57.75
  Top 0.203: v24.71,23.77 24.71,22.49 JP10.1 | RN4.4 28.92,26.43 v29.16,26.2 | v33.4,27.81 33.4,28.18 34.21,28.99 34.21,30 47,42.79 47.74,42.79 48.14,43.19 v48.14,44.15
  Bottom 0.203: v24.71,23.77 26.73,23.77 v29.16,26.2 29.16,26.76 30.21,27.81 v33.4,27.81 | v48.14,44.15 48.05,44.23 48.05,56.36 48.65,56.96 v48.65,57.75
ETH_MDC  (via drill 0.3)
  Top 0.152: IC4.33 63.31,56.09 63.15,56.25 63.15,57.24 v63.18,57.26 v63.19,57.26
  Top 0.203: IC16.31 19.85,30.16 | v50.82,55.69 44.92,55.69 v44.42,55.19
  Top 0.254: v23.53,33.24 22.93,33.24 19.85,30.16
  Bottom 0.152: v63.19,57.26 62.21,57.26 60.17,55.22 51.29,55.22 v50.82,55.69
  Bottom 0.203: v23.53,33.24 23.53,33.85 44.42,54.74 v44.42,55.19
ETH_MDIO  (via drill 0.3)
  Top 0.152: IC4.42 58.81,56.12 58.62,56.31 54.71,56.31 54.51,56.52 45.74,56.52 v45.73,56.5
  Top 0.203: IC16.30 18.3,29.31 18.3,24.46 R38.1
  Top 0.254: v24.57,33.93 22.92,33.93 IC16.30
  Bottom 0.203: v24.57,33.93 24.57,34.3 45.73,55.46 v45.73,56.5
ETH_RX_CLK  (via drill 0.3)
  Top 0.152: IC4.41 59.31,56.15 58.78,56.68 54.87,56.68 54.67,56.88 48.2,56.88 v47.93,57.17
  Top 0.203: RN4.2 28.5,24.63 28.96,25.09 31.09,25.09 32.15,26.16 32.15,27.53 33.79,29.17 33.79,30.16 47.1,43.47 v47.46,43.47
  Bottom 0.203: v47.93,57.17 47.65,56.9 47.65,44.62 47.46,44.42 v47.46,43.47
ETH_RX_DV  (via drill 0.3)
  Top 0.203: 27.84,25.51 30.91,25.51 31.75,26.35 31.75,27.71 33.38,29.35 33.38,30.34 48.69,45.64 49.42,45.64 51.23,47.45 v51.23,47.65 | IC4.53 54.17,49.41 v54.01,49.57
  Top 0.254: 27.84,25.51 RN4.3 27.74,25.51
  Bottom 0.203: v51.23,47.65 52.09,47.65 v54.01,49.57
ETH_RX_ER  (via drill 0.3)
  Top 0.203: v30.93,26.49 RN5.1 | 29.11,22.05 29.11,22.2 29.78,22.2 v30.95,23.37
  Top 0.254: JP13.1 29.07,22.01 29.11,22.05 27.11,22.05 JP11.1
  Bottom 0.203: v30.93,26.49 30.93,23.38 v30.95,23.37
ETH_RX_ERR  (via drill 0.3)
  Top 0.152: JP13.2 32.45,20.84 v34.48,22.87 | IC4.79 54.98,36.41 54.82,36.56 54.82,37.22 53.87,38.18 42.94,38.18 40.47,35.71 v40.47,31.98
  Bottom 0.152: v34.48,22.87 36.85,22.87 39.9,25.92 39.9,30.73 40.47,31.3 v40.47,31.98
ETH_RXD0  (via drill 0.3)
  Top 0.203: 30.94,28.84 31.33,28.84 | RN5.3 31.5,28.83 32.55,29.88 32.55,30.68 49.22,47.36 v49.59,47.36 | IC4.54 53.66,48.91 53.49,48.74 49.79,48.74 v49.55,48.98
  Top 0.254: 30.94,28.84 RN5.3
  Bottom 0.203: v49.59,47.36 49.59,48.97 v49.55,48.98
ETH_RXD1
  Top 0.203: RN5.4 31.64,29.73 32.14,30.24 32.14,30.86 49.6,48.32 53.65,48.32 53.74,48.41 IC4.55
  Top 0.254: 30.8,29.7 RN5.4
ETH_RXD2  (via drill 0.3)
  Top 0.203: IC4.83 54.79,34.41 54.06,33.68 49.21,33.68 48.65,34.24 46.3,34.24 v45.96,33.9 | RN6.1 32.68,32.34 v34.26,33.92
  Bottom 0.203: v34.26,33.92 34.49,34.15 45.73,34.15 v45.96,33.9
ETH_RXD3  (via drill 0.3)  (1 unrouted)
  Top 0.203: IC4.84 54.89,33.91 54.25,33.27 49.02,33.27 48.48,33.81 46.82,33.81 46.13,33.12 v45.42,33.12 | RN6.2 v32.61,33.24
  Bottom 0.203: v32.62,33.24 34.54,33.24 35.03,33.73 44.81,33.73 v45.42,33.12
ETH_TX_CLK  (via drill 0.3)
  Top 0.152: IC4.35 62.31,56.39 v62.51,56.58
  Top 0.203: RN6.3 31.43,34.14 v31.53,34.24 | v44.01,52.79 44.01,53.44 45.37,54.8 49.96,54.8 v50.17,55.02
  Bottom 0.152: v62.51,56.58 62.05,56.58 60.33,54.86 50.33,54.86 v50.17,55.02
  Bottom 0.203: v31.53,34.24 31.53,40.68 43.65,52.79 v44.01,52.79
ETH_TX_EN  (via drill 0.3)
  Top 0.203: IC4.80 54.88,35.91 54.4,36.39 54.4,37.07 53.7,37.77 43.43,37.77 v42.21,36.55 | RN6.4 34.75,35.04 v35.86,36.16
  Bottom 0.203: v35.86,36.16 41.8,36.14 v42.21,36.55
ETH_TXD0  (via drill 0.3)
  Top 0.203: IC4.85 54.97,33.41 54.43,32.87 48.48,32.87 v48.22,33.13 | RN7.1 34.36,36.08 v34.43,36.14
  Bottom 0.203: v48.22,33.13 48.22,33.31 46.55,34.98 35.25,34.98 34.43,35.8 v34.43,36.14
ETH_TXD1  (via drill 0.3)
  Top 0.203: IC4.86 55.05,32.91 54.61,32.46 47.95,32.46 47.27,33.15 v47.1,33.15 | RN7.2 33.21,36.98 v33.42,36.77
  Bottom 0.203: v33.42,36.77 33.42,36.21 35.06,34.57 46.38,34.57 47.1,33.85 v47.1,33.15
ETH_TXD2  (via drill 0.3)
  Top 0.152: IC4.34 62.81,54.72 62.56,54.46 59.52,54.46 v59.28,54.22
  Top 0.203: RN7.3 38.57,37.88 46.87,46.18 46.87,46.88 v46.97,46.98 | v46.97,51.49 46.97,51.79 v49.32,54.14
  Bottom 0.203: v59.28,54.22 59.03,54.47 50.59,54.47 50.41,54.29 49.48,54.29 v49.32,54.14 | v46.97,51.49 v46.97,46.98
ETH_TXD3  (via drill 0.3)
  Top 0.203: RN7.4 38.88,38.78 46.2,46.1 v46.2,46.44 | IC4.167 v80.3,48.91
  Bottom 0.203: v46.2,46.44 46.2,47.18 46.3,47.28 46.3,51.79 47.24,52.73 47.24,57.7 49.31,59.77 63.13,59.77 64.11,60.74 68.53,60.74 71.06,58.2 76.28,58.2 78.42,56.07 78.42,51.44 80.3,49.55 v80.3,48.91
FMC_A0  (via drill 0.3)
  Top 0.254: v66.11,51.13 66.72,51.13 arc-90 66.95,50.9 66.95,50.49 arc180 67.57,50.49 67.57,50.9 arc-180 68.19,50.9 68.19,50.46 arc180 68.82,50.46 68.82,50.91 arc-180 69.44,50.91 69.44,50.44 arc180 70.06,50.44 70.06,50.91 arc-180 70.68,50.91 70.68,50.46 | 70.68,50.46 70.68,50.44 | 70.68,50.46 arc180 71.31,50.46 71.31,51.04 arc-37 71.65,51.8 71.92,52.05 arc45 72.11,52.5 72.11,53.97 arc45 71.93,54.39 71.88,54.45 arc-45 71.81,54.6 71.81,54.62 arc-45 71.81,54.63 IC4.16
  Bottom 0.254: IC7.23 63.9,49.86 arc27 64.44,49.99 arc47 64.61,50.39 64.61,50.71 arc-74 65.17,51.13 v66.11,51.13
FMC_A1  (via drill 0.3)
  Top 0.254: v65.52,51.83 65.58,51.83 arc90 66.07,52.32 arc-180 66.53,52.32 66.53,51.82 arc180 66.99,51.82 66.99,52.36 arc-180 67.45,52.36 67.45,51.92 arc180 67.9,51.92 67.9,52.35 arc-180 68.36,52.35 68.36,51.83 arc180 68.82,51.83 68.82,52.41 arc-180 69.28,52.41 69.28,51.84 arc180 69.73,51.84 69.73,52.4 arc-180 70.19,52.4 70.19,51.96 arc180 70.65,51.96 70.65,52.4 arc-90 71.2,52.88 arc90 71.59,53.27 71.59,53.76 arc45 71.47,54.05 arc-45 71.31,54.43 IC4.17
  Bottom 0.254: IC7.24 63.7,50.66 63.94,50.66 arc90 64.14,50.86 arc-90 64.87,51.59 arc41 v65.52,51.83
FMC_A2  (via drill 0.3)
  Top 0.254: 70.86,53.59 arc-45 v70.85,53.56 arc-45 70.81,53.64 IC4.18
  Bottom 0.254: IC7.25 63.46,51.46 arc45 63.91,51.65 64.62,52.35 arc-45 65.07,52.54 66.43,52.54 arc-90 66.85,52.12 66.85,50.46 | 66.85,50.46 66.85,50.44 | 67.34,50.46 67.34,52.12 arc-180 67.84,52.12 67.84,50.46 arc180 68.34,50.46 68.34,52.12 arc-180 68.83,52.12 | 67.34,50.46 67.34,50.44 | 66.85,50.46 arc180 67.34,50.46 | 68.83,52.13 68.83,52.12 | 68.83,52.12 68.83,51.51 arc180 69.33,51.51 69.33,52.13 arc-45 69.58,52.74 arc-2 69.94,53.09 arc-35 v70.85,53.56
FMC_A3  (via drill 0.3)
  Top 0.254: 65.08,53.09 65.08,53.11 | 65.08,53.11 65.08,54.01 arc90 64.8,54.34 63.31,54.34 arc180 63.31,53.89 63.66,53.89 arc-45 64.11,53.7 64.16,53.66 arc-45 64.23,53.47 v64.23,53.1 | 65.08,53.11 arc180 65.77,53.11 65.77,54.03 arc-180 66.45,54.03 66.45,53.31 arc180 67.14,53.31 | 67.14,53.31 67.14,54.01 arc-180 67.83,54.01 67.83,53.47 arc90 68.19,53.1 69.7,53.1 arc45 70.01,53.23 70.06,53.28 arc45 70.15,53.49 70.15,53.75 arc-37 70.22,53.94 arc45 70.31,54.18 IC4.19 | 67.14,53.3 67.14,53.31
  Bottom 0.254: IC7.26 63.54,52.26 arc45 63.99,52.45 64.05,52.51 arc45 64.23,52.95 v64.23,53.1
FMC_A4  (via drill 0.3)
  Top 0.254: IC4.20 69.81,54.3 arc-45 69.7,54.03 v69.45,53.78
  Bottom 0.254: IC7.29 73.38,52.26 arc90 73.03,51.92 73.03,51.6 arc-90 72.79,51.36 70.15,51.36 arc-180 70.15,51.82 72.33,51.82 arc180 72.33,52.27 70.37,52.27 arc-180 70.37,52.73 72.36,52.73 arc180 72.36,53.19 71.79,53.19 arc-180 71.79,53.65 71.88,53.65 arc180 71.88,54.28 70.77,54.28 arc45 70.32,54.09 70.14,53.91 arc-45 69.83,53.78 v69.45,53.78
FMC_A5  (via drill 0.3)
  Top 0.254: IC4.21 69.31,54.91 arc-45 69.15,54.51 69.16,54.51 69.03,54.38 arc-45 68.58,54.19 v68.54,54.19
  Bottom 0.254: IC7.30 75.23,51.46 arc90 75.81,52.12 arc-24 75.98,53.21 arc18 76.09,53.93 76.09,55.28 arc180 75.62,55.28 75.62,54.69 arc-180 75.16,54.69 75.16,55.28 arc180 74.69,55.28 74.69,54.71 arc-180 74.22,54.71 74.22,55.28 arc180 73.75,55.28 73.75,54.72 | 73.75,54.72 73.75,54.71 | 73.75,54.72 arc-180 73.1,54.72 arc84 72.56,55.21 69.11,55.21 arc45 68.72,55.04 arc45 68.54,54.61 v68.54,54.19
FMC_A6  (via drill 0.3)
  Top 0.254: IC4.60 59.69,45.91 arc45 60.14,46.09 63.53,49.48 arc-45 63.98,49.67 71.13,49.67 arc45 71.58,49.86 72.36,50.64 arc45 v72.37,50.66
  Bottom 0.254: IC7.31 v72.38,50.66 arc-45 v72.37,50.66
FMC_A7  (via drill 0.3)
  Top 0.254: v72.93,49.86 72.52,49.86 arc45 72.07,49.67 71.77,49.37 arc-45 71.32,49.19 64.17,49.19 arc45 63.72,49 59.69,44.98 arc-45 59.24,44.79 57.13,44.79 arc45 56.92,44.7 56.81,44.59 arc-45 56.36,44.41 IC4.63
  Bottom 0.254: IC7.32 v72.93,49.86
FMC_A8  (via drill 0.3)
  Top 0.254: IC4.64 56.55,43.91 arc45 56.93,44.07 56.99,44.12 arc-45 57.44,44.31 59.44,44.31 arc45 59.88,44.5 63.92,48.53 arc-45 64.37,48.72 71.82,48.72 arc45 72.27,48.9 v72.31,48.95
  Bottom 0.254: IC7.33 72.42,49.06 v72.31,48.95
FMC_A9  (via drill 0.3)
  Top 0.254: IC4.65 56.67,43.41 arc45 57.12,43.59 57.18,43.65 arc-45 57.62,43.84 59.61,43.84 arc45 60.06,44.03 64.11,48.07 arc-45 64.56,48.26 v73,48.26
  Bottom 0.254: IC7.34 v73,48.26
FMC_A10  (via drill 0.3)
  Top 0.254: IC4.66 57.55,42.91 v57.78,43.14
  Bottom 0.254: v57.78,43.14 57.78,43.17 arc-90 58.25,43.64 60.07,43.64 arc180 60.07,44.09 58.05,44.09 arc-180 58.05,44.55 59.47,44.55 arc180 59.47,45.01 58.3,45.02 arc-90 57.83,45.49 57.83,47.93 arc-45 58.02,48.38 58.97,49.33 arc-45 59.42,49.52 61.66,49.51 arc-45 62.02,49.35 62.13,49.24 arc45 62.58,49.06 IC7.22
FMC_A11  (via drill 0.3)
  Top 0.254: IC4.67 58.98,42.41 arc45 59.43,42.59 64.22,47.39 arc-45 64.67,47.57 72.07,47.57 arc-45 v72.35,47.46
  Bottom 0.254: IC7.35 v72.35,47.46
FMC_A12  (via drill 0.3)  (1 unrouted)
  Top 0.254: v75.34,44.95 71.52,41.12 arc45 71.33,40.67 71.34,40.66 71.34,32.86 arc45 71.5,32.48 v71.56,32.42 | IC4.110 68.32,29.92 v68.32,31.69
  Bottom 0.254: v75.34,44.95 75.34,45.75 arc45 75.16,46.2 74.88,46.47 arc45 74.44,46.66 IC7.36 | v71.56,32.42 70.47,32.42 arc45 70.02,32.24 69.64,31.86 arc-45 69.19,31.68 68.33,31.68
FMC_BA0  (via drill 0.3)
  Top 0.254: IC4.112 69.31,39.4 arc45 69.13,39.85 64.76,44.21 arc-45 64.58,44.66 64.58,45.77 arc45 64.41,46.16 v64.28,46.29
  Bottom 0.254: IC7.20 63.55,47.46 arc-45 64,47.27 64.13,47.14 arc-45 64.28,46.77 v64.28,46.29
FMC_BA1  (via drill 0.3)
  Top 0.254: IC4.113 69.81,39.55 arc45 69.63,39.99 65.45,44.17 arc-45 65.26,44.62 v65.26,46.51
  Bottom 0.254: IC7.21 63.55,48.26 arc-45 64,48.07 65.08,47 arc-45 65.26,46.55 v65.26,46.51
FMC_D0  (via drill 0.3)
  Top 0.254: IC4.97 61.81,30.61 61.46,30.96 v61.46,31.11
  Bottom 0.254: v61.46,31.11 61.11,30.76 57.81,30.76 arc-180 57.81,31.22 60.56,31.22 arc180 60.56,31.67 57.95,31.67 arc-180 57.95,32.13 61.19,32.13 arc-45 61.64,31.95 61.72,31.86 arc45 62.17,31.67 63.68,31.67 arc45 63.95,31.79 arc45 64.08,32.09 64.08,32.6 arc45 63.98,32.84 63.95,32.87 arc45 63.5,33.06 IC7.2
FMC_D1  (via drill 0.3)
  Top 0.254: 62.3,29.92 IC4.98 62.31,30.89 v62.42,30.98
  Bottom 0.254: IC7.4 66.39,34.66 arc-180 66.39,34.2 65.3,34.2 arc45 64.85,34.02 64.77,33.94 arc45 64.59,33.49 64.59,32.49 arc66 64.92,32.27 66.47,32.27 arc-180 66.47,31.81 64.79,31.81 arc180 64.79,31.37 65.98,31.37 arc-180 65.98,30.91 62.64,30.91 arc-45 v62.42,30.98
FMC_D2  (via drill 0.3)
  Top 0.254: v72.04,35.67 72.12,35.6 73.9,35.6 arc45 74.35,35.78 74.46,35.9 arc-45 74.91,36.08 76.62,36.08 arc45 77.07,36.27 77.08,36.28 arc-45 77.39,36.41 IC4.142
  Bottom 0.254: v72.04,35.67 v72.04,35.68 arc45 71.59,35.87 68.32,35.87 arc45 67.87,35.68 67.62,35.43 arc-45 67.17,35.24 65.96,35.24 arc-45 65.51,35.43 64.54,36.4 arc84 64.14,36.44 arc84 64.11,36.02 64.35,35.78 arc-22 64.49,35.6 arc-107 64.23,35.26 64.22,35.26 arc-45 63.77,35.44 63.75,35.46 | IC7.5 63.75,35.46 | 63.75,35.46 arc-45 63.75,35.46
FMC_D3  (via drill 0.3)
  Top 0.254: IC4.143 81.3,36.89 77.98,36.89 arc-45 77.53,37.08 77.26,37.35 arc45 76.81,37.54 75.62,37.54 arc45 75.17,37.35 74.33,36.51 arc-45 73.88,36.32 v72.81,36.32
  Bottom 0.254: v72.81,36.32 72.75,36.37 71.92,36.37 arc-90 71.66,36.63 71.66,36.85 arc180 71.2,36.85 71.2,36.51 arc-90 71.02,36.32 68.13,36.32 arc45 67.68,36.14 67.52,35.98 arc-45 67.07,35.79 66.08,35.79 arc-45 65.63,35.98 64.74,36.87 arc45 64.29,37.06 IC7.7
FMC_D4  (via drill 0.3)
  Top 0.254: IC4.68 64.22,41.91 arc45 64.67,42.09 v64.85,42.28
  Bottom 0.254: IC7.8 63.81,37.86 63.84,37.86 arc90 64.12,38.14 arc-90 64.61,38.73 65,38.73 arc180 65,39.2 64.22,39.2 arc-180 64.22,39.64 64.79,39.64 arc93 65.26,40.13 65.26,40.37 arc93 64.77,40.84 64.23,40.84 arc-180 64.23,41.3 65.67,41.3 arc90 65.88,41.52 65.88,42.09 arc90 65.69,42.28 v64.85,42.28
FMC_D5  (via drill 0.3)
  Top 0.254: IC4.69 57.5,41.41 arc-45 57.95,41.22 v57.97,41.2
  Bottom 0.254: IC7.10 61.06,39.46 arc90 59.75,38.15 59.75,35.99 arc-180 59.25,35.99 59.25,37.94 arc180 58.76,37.94 58.76,35.99 arc-180 58.3,35.99 58.3,38.81 arc90 58.06,39.05 57.86,39.05 arc-90 57.62,39.29 arc-90 57.86,39.53 58.06,39.53 arc90 58.3,39.78 58.3,40.61 arc45 58.12,41.05 v57.97,41.2
FMC_D6  (via drill 0.3)
  Top 0.254: IC4.70 56.57,40.91 arc-45 57.01,40.73 arc-45 57.09,40.51 v57.09,40.18
  Bottom 0.254: IC7.11 62.45,40.26 62.12,39.93 60.12,39.93 59.86,40.18 59.86,42.69 arc180 59.39,42.69 59.39,38.96 arc-180 58.92,38.96 58.92,42.69 arc180 58.45,42.69 58.45,42.11 58.25,41.91 57.63,41.91 57.12,41.4 57.12,40.24 arc-45 v57.09,40.18 57.12,40.21
FMC_D7  (via drill 0.3)
  Top 0.254: IC4.73 65.44,39.41 arc45 65.89,39.59 v65.98,39.69
  Bottom 0.254: v65.98,39.69 66.34,40.04 66.34,41.21 arc-97 66.63,41.54 67.09,41.54 arc180 67.09,42.04 66.63,42.04 arc-180 66.63,42.53 67.09,42.53 arc180 67.09,42.99 64.53,42.99 arc45 64.28,42.89 arc45 64.13,42.52 64.13,42.41 arc-45 64.01,42.12 63.88,41.99 arc-45 63.57,41.86 IC7.13
FMC_D8  (via drill 0.3)
  Top 0.254: IC4.74 60.31,38.91 arc45 60.38,38.94 arc-45 60.41,38.95 65.5,38.95 arc-45 v65.94,38.77
  Bottom 0.254: 74.05,41.87 IC7.42 73.25,41.86 arc-90 73.02,42.09 73.02,42.44 arc180 72.56,42.44 72.56,42.13 arc-45 72.38,41.69 69.65,38.96 arc-45 69.2,38.77 v65.94,38.77
FMC_D9  (via drill 0.3)
  Top 0.254: IC4.75 59.16,38.41 arc-45 59.61,38.22 60.12,37.71 arc45 60.57,37.53 64.08,37.53 arc45 64.53,37.71 v64.84,38.02
  Bottom 0.254: IC7.44 74.05,40.27 73.24,40.27 arc-90 73.01,40.5 73.01,40.82 arc180 72.55,40.82 72.55,40.5 arc-87 72.33,40.27 71.88,40.27 arc45 71.43,40.09 69.84,38.5 arc-45 69.39,38.32 66.62,38.32 arc45 66.32,38.19 arc-45 65.92,38.02 v64.84,38.02
FMC_D10  (via drill 0.3)
  Top 0.254: IC4.76 58.91,37.91 arc-45 59.36,37.72 59.84,37.24 arc45 60.29,37.06 64.96,37.06 arc45 65.41,37.24 v65.43,37.26
  Bottom 0.254: IC7.45 73.07,39.46 arc90 72.7,39.09 arc-180 72.23,39.09 72.23,39.46 arc180 71.76,39.46 71.76,39.2 arc-90 71.43,38.88 71.12,38.88 arc45 70.68,38.69 70.02,38.03 arc-45 69.57,37.85 66.9,37.85 arc45 66.45,37.66 66.23,37.45 arc-45 65.79,37.26 v65.43,37.26
FMC_D11  (via drill 0.3)
  Top 0.254: IC4.77 58.67,37.41 arc-45 59.12,37.22 59.64,36.7 arc45 60.09,36.51 v66.09,36.51
  Bottom 0.254: IC7.47 73.26,37.86 73.12,38 73.12,38.24 arc180 72.67,38.24 72.67,37.94 arc-180 72.21,37.94 72.21,38.19 arc90 71.98,38.42 71.33,38.42 arc45 70.88,38.23 70.21,37.56 arc-45 69.76,37.38 67.21,37.38 arc45 66.77,37.19 v66.09,36.51
FMC_D12  (via drill 0.3)
  Top 0.254: IC4.78 58.43,36.91 arc-45 58.88,36.72 60.34,35.26 arc45 60.79,35.08 61.51,35.08 arc45 61.95,35.26 62.32,35.63 arc-45 62.77,35.81 66.31,35.81 arc45 66.58,35.93 67.08,36.43 arc45 v67.15,36.6
  Bottom 0.254: IC7.48 | IC7.48 72.39,37.06 arc-37 72.06,37.22 arc-15 71.84,37.5 arc-27 71.79,37.67 arc50 71.65,37.92 arc60 71.12,37.78 arc0 70.88,37.54 arc45 70.79,37.33 70.79,37.16 arc-90 70.44,36.85 67.67,36.85 arc45 67.22,36.67 v67.15,36.6 | IC7.48
FMC_D13  (via drill 0.3)
  Top 0.254: v65.3,32.99 65.12,32.82 59.42,32.82 arc45 58.97,32.63 58,31.66 arc45 57.81,31.21 IC4.89
  Bottom 0.254: IC7.50 74.05,35.45 73.11,35.45 arc45 72.66,35.26 72.56,35.16 arc-45 72.11,34.98 71.2,34.98 arc90 70.96,34.73 arc-180 70.51,34.73 70.51,34.87 arc180 70.05,34.87 70.05,34.76 arc-180 69.59,34.76 69.59,34.8 arc90 69.21,35.13 68.34,35.13 arc45 67.9,34.94 66.13,33.18 arc-45 65.68,32.99 v65.3,32.99
FMC_D14  (via drill 0.3)
  Top 0.254: v66.87,32.96 66.41,32.49 arc-45 65.96,32.31 59.71,32.31 arc45 59.26,32.12 58.5,31.36 arc45 58.31,30.91 IC4.90
  Bottom 0.254: IC7.51 72.89,34.66 arc90 72.55,34.31 72.55,33.86 arc-180 71.94,33.86 71.94,34.2 arc180 71.33,34.2 arc-96 71.08,33.97 69.41,33.97 arc-90 69.16,34.23 69.16,34.34 arc90 68.84,34.66 68.52,34.66 arc45 68.07,34.47 67.06,33.46 arc45 66.87,33.01 v66.87,32.96
FMC_D15  (via drill 0.3)
  Top 0.254: IC4.91 58.81,30.59 arc-45 59,31.04 59.6,31.64 arc-45 60.05,31.83 66.46,31.83 arc45 66.91,32.01 67.62,32.72 arc45 v67.79,33.13
  Bottom 0.254: 68.77,33.86 68.77,33.85 | 68.77,33.85 68.77,32.58 arc180 69.22,32.58 69.22,33.03 arc-90 69.68,33.49 71.18,33.49 arc-45 71.63,33.3 71.7,33.24 arc45 72.13,33.06 IC7.53 | 68.77,33.85 arc180 68.31,33.85 68.31,33.36 arc-90 68.06,33.13 v67.79,33.13
FMC_NBL0  (via drill 0.3)
  Top 0.254: IC4.169 80.54,49.91 arc45 80.09,49.73 76.67,46.31 arc-45 76.22,46.13 70.26,46.13 arc45 69.89,46.02 v69.69,45.82
  Bottom 0.254: IC7.15 67.07,43.46 arc45 67.52,43.65 v69.69,45.82
FMC_NBL1  (via drill 0.3)
  Top 0.254: 74.79,46.91 arc-180 74.79,47.54 77.01,47.54 arc180 77.01,48.16 74.84,48.16 arc45 74.84,48.16 arc-180 74.84,48.78 78.16,48.78 arc45 78.61,48.97 79.86,50.22 arc-45 80.31,50.41 IC4.170 | 74.79,46.91 arc-45 74.79,46.91 | 74.79,46.91 v76.04,46.91
  Bottom 0.254: IC7.39 75.83,44.26 75.83,44.26 arc90 76.04,44.54 v76.04,46.91 arc-45 v76.04,46.91
FMC_SDCKE0  (via drill 0.3)
  Top 0.254: IC4.43 58.31,54.43 arc45 58.44,54.07 61.9,50.6 arc45 62.35,50.42 v65.36,50.42
  Bottom 0.254: IC7.37 71.79,45.86 arc-45 71.34,46.05 70.69,46.69 arc45 70.24,46.88 67.26,46.88 arc-45 66.81,47.06 65.55,48.33 arc-45 65.36,48.78 v65.36,50.42
FMC_SDCLK  (via drill 0.3)
  Top 0.254: v71.2,42.9 70.96,42.66 arc45 70.79,42.21 70.79,32.39 arc45 70.97,31.95 71.18,31.74 arc-45 71.31,31.41 IC4.116
  Bottom 0.254: IC7.38 73.63,45.06 arc45 73.18,44.87 v71.2,42.9
FMC_SDNCAS  (via drill 0.3)
  Top 0.254: v67.12,45.07 70.27,45.07 arc45 70.72,45.26 70.93,45.47 arc-45 71.38,45.66 75.59,45.66 arc-45 75.78,45.58 arc45 76.19,45.41 IC4.160
  Bottom 0.254: IC7.17 67.09,45.06 arc45 v67.12,45.07
FMC_SDNE0  (via drill 0.3)
  Top 0.254: IC4.44 57.81,54.26 arc45 58,53.81 60.97,50.83 arc-45 61.16,50.38 v61.16,48.27
  Bottom 0.254: IC7.19 62.36,46.66 arc-45 61.91,46.84 61.34,47.41 arc-45 61.16,47.86 v61.16,48.27
FMC_SDNRAS  (via drill 0.3)
  Top 0.254: IC4.59 59.15,46.41 arc45 59.6,46.59 v60.14,47.12
  Bottom 0.254: IC7.18 61.66,45.86 arc-45 61.22,46.05 v60.14,47.12
FMC_SDNWE  (via drill 0.3)
  Top 0.254: IC4.46 56.52,52.91 arc-45 56.96,52.72 58.57,51.11 arc-45 58.76,50.66 v58.76,47.32
  Bottom 0.254: IC7.16 61.66,44.26 arc-45 61.22,44.45 58.95,46.72 arc-45 58.76,47.16 v58.76,47.32
FRM2
  cutout Gnd: 136.7,62.14 134.42,62.14 134.42,67.47 136.7,67.47
  cutout Top: 136.7,62.14 134.42,62.14 134.42,67.47 136.7,67.47
FRM3
  cutout Power: 136.7,62.14 134.42,62.14 134.42,67.47 136.7,67.47
GND  (via drill 0.3)
  Top 0.152: 91.98,18.4 C52.- | v88.78,15.1 IC11.2 | v113.52,15.94 C8.2 | C7.1 v104.99,15.95 | v107.62,19.75 C5.1 | IC15.3 | v57.97,3.26 58.12,1.91 C41.2 | v129.24,12.89 C3.1 | C9.2 v115.36,16.51 | IC2.4 118.97,16.54 v118.97,16.55 | C31.2 23.14,16.6 v23.47,16.93 | IC8.7 88.32,46 v88.3,45.99 | C40.1 v90.89,42.24 | v42.38,28.69 42.19,28.5 IC3.8